# EAGLE design dimmer_encoder_controller (EAGLE 9.2.2)
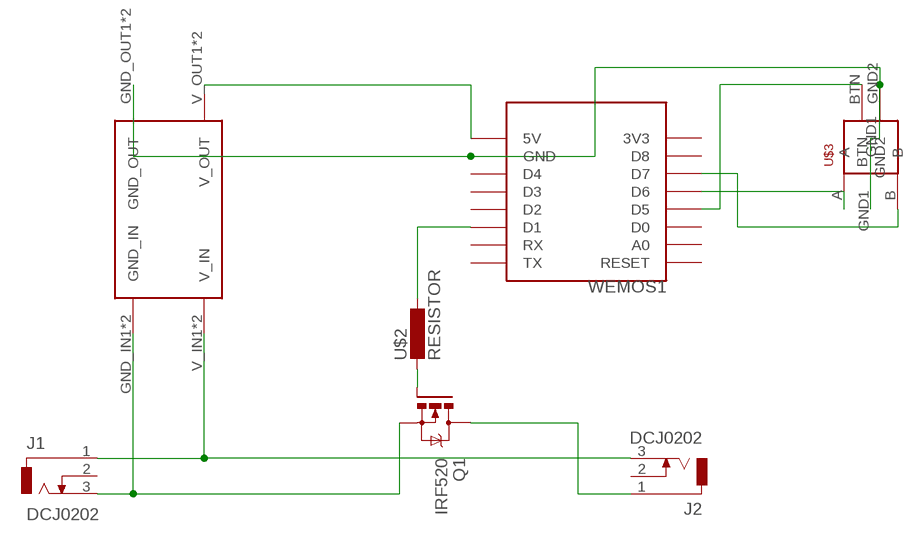
[diagram p0: schematic, sheet 1]

## Parts
J1  DCJ0202  [DCJ0202]
J2  DCJ0202  [DCJ0202]
Q1  IRF520  [TO220BV]
U$1  DC-DC-CONVERTER  [DC-DC-CONVERTER]
U$2  RESISTOR  [RESISTOR]
U$3  ROTARY_ENCODER  [ROTARY_ENCODER]
WEMOS1  WEMOS-D1-MINI  [WEMOS-D1-MINI]

## Nets
N$1: Q1.G U$2.2
N$2: U$1.V_OUT1(V_OUT) U$1.V_OUT2(V_OUT) WEMOS1.5V
N$3: U$1.GND_OUT1(GND_OUT) U$1.GND_OUT2(GND_OUT) U$3.GND1 U$3.GND2 WEMOS1.GND
N$4: U$2.1 WEMOS1.D1
N$5: J1.1 J2.3 U$1.V_IN1(V_IN) U$1.V_IN2(V_IN)
N$6: J1.3 Q1.S U$1.GND_IN1(GND_IN) U$1.GND_IN2(GND_IN)
N$7: J2.1 Q1.D
N$9: U$3.A WEMOS1.D6
N$10: U$3.B WEMOS1.D7
N$11: U$3.BTN WEMOS1.D5
Unconnected: J1.2 J2.2 WEMOS1.3V3 WEMOS1.A0 WEMOS1.D0 WEMOS1.D2 WEMOS1.D3 WEMOS1.D4 WEMOS1.D8 WEMOS1.RESET WEMOS1.RX WEMOS1.TX

## Library data of the parts
J1 J2 = con-jack:DCJ0202: DC POWER JACK Source: DCJ0202.pdf; OC_FARNELL: unknown; OC_NEWARK: unknown
Q1 = transistor-power:IRF520: HEXFET Power MOSFET
U$1 = mylib:DC-DC-CONVERTER
U$2 = mylib:RESISTOR
U$3 = mylib:ROTARY_ENCODER
WEMOS1 = esp8266modules:WEMOS-D1-MINI: WeMos.cc D1 mini ESP8266 module

## Board
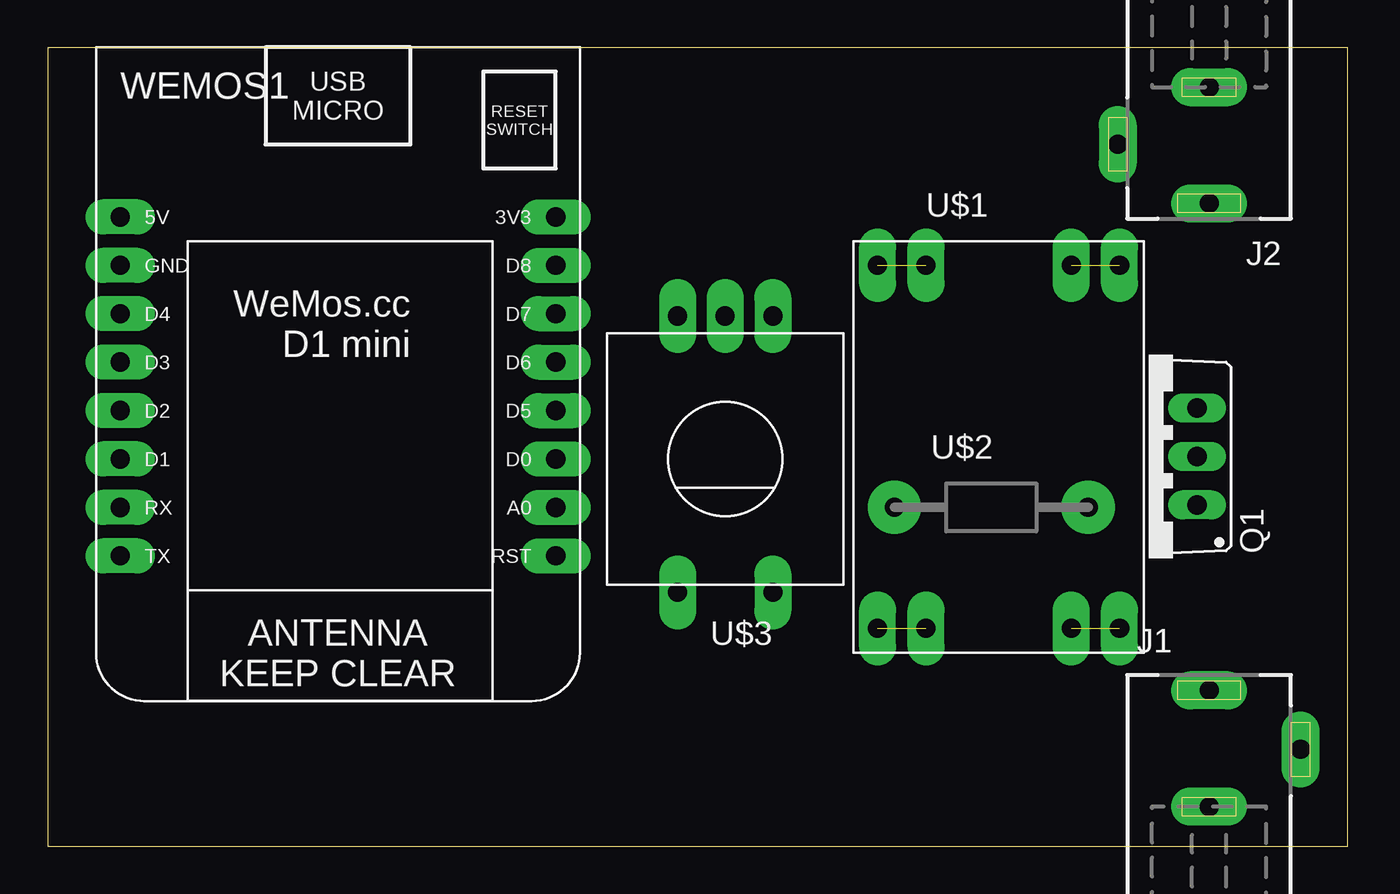
[diagram p1: board, top side]
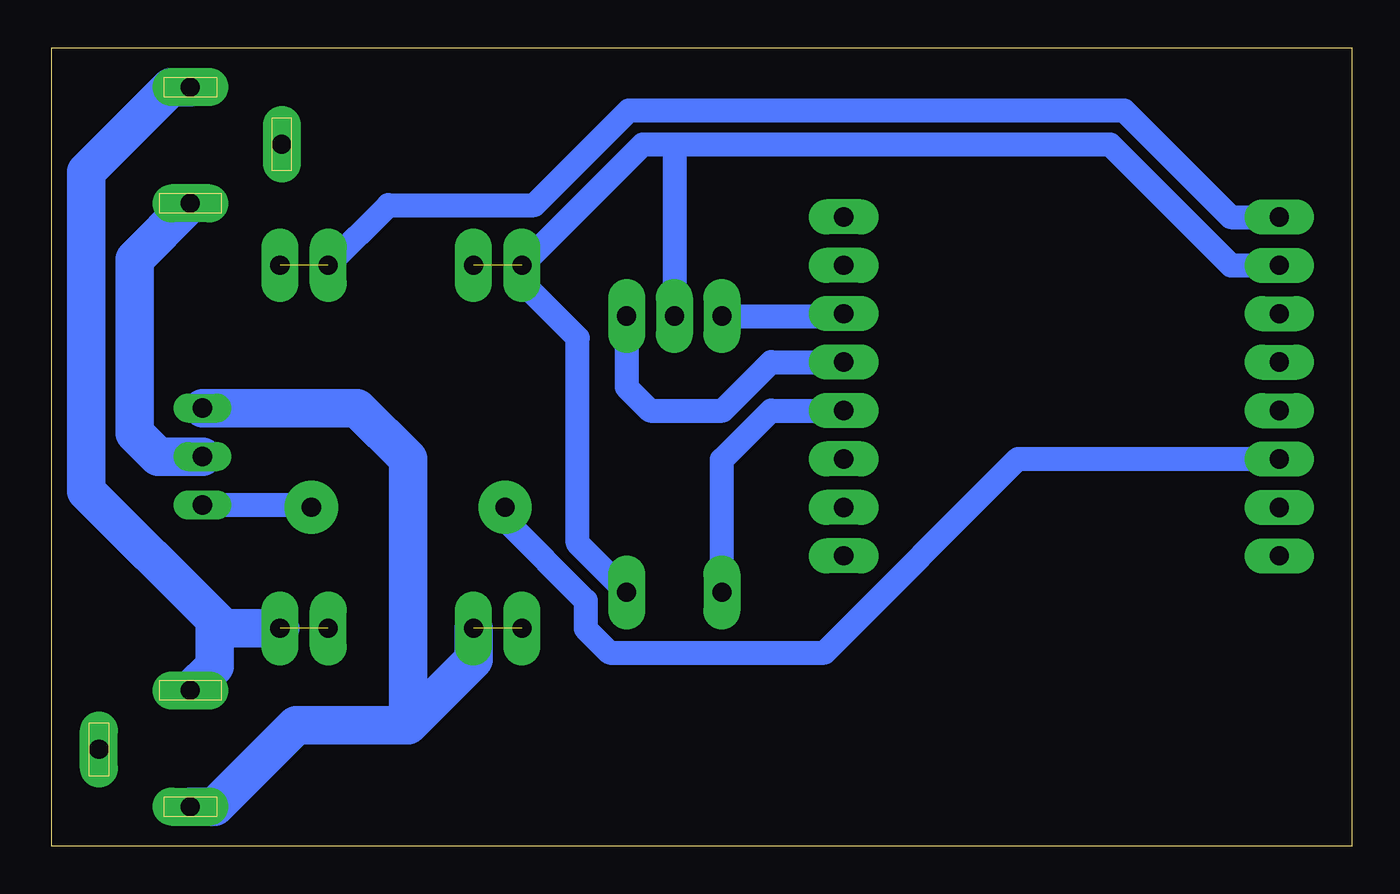
[diagram p2: board, bottom side, seen from below]

Size 68.25 x 41.9 mm. Coordinates in mm from the lower left corner, seen from the top.
Outline: 0,0 68.25,0 68.25,41.9 0,41.9 0,0
Copper layers (1*16): Top 0.035mm / dielectric 1.5mm / Bottom 0.035mm
Design rules "default": minimum track width 6mil, minimum drill 0.8mm, track to track 20mil, track to pad 20mil, pad to pad 10mil, via to via 10mil, smd to smd 6mil, copper to edge 40mil, drill to drill 6mil, minimum pad ring 10mil, minimum via ring 8mil, stop-mask expansion 4mil, vias tented up to drill 0mil, thermal gap 10mil

### Footprints (pad centres in the part's own frame; a part is rotated, then mirrored left to right if it is on the bottom)
DCJ0202 = drill 1 pad 2 long: 1 0,3.1; 2 4.8,0; 3 0,-3
TO220BV = drill 1.016 long: D 0,-2.54; G -2.54,-2.54; S 2.54,-2.54
DC-DC-CONVERTER = drill 1 pad 1.93 long: GND_IN1 -5.08,-11.43; GND_IN2 -2.54,-11.43; GND_OUT1 -5.08,7.62; GND_OUT2 -2.54,7.62; V_IN1 5.08,-11.43; V_IN2 7.62,-11.43; V_OUT1 5.08,7.62; V_OUT2 7.62,7.62
RESISTOR = drill 1 pad 2.794: 1 -7.62,0; 2 2.54,0
ROTARY_ENCODER = drill 1 pad 1.93 long: A -2.5,-7.5; B 2.5,-7.5; BTN 2.5,7; GND1 0,-7.5; GND2 -2.5,7
WEMOS-D1-MINI = drill 1.016 pad 1.829 long: 3V3 -10.16,-10.16; 5V 12.7,-10.16; A0 -10.16,5.08; D0 -10.16,2.54; D1 12.7,2.54; D2 12.7,0; D3 12.7,-2.54; D4 12.7,-5.08; D5 -10.16,0; D6 -10.16,-2.54; D7 -10.16,-5.08; D8 -10.16,-7.62; GND 12.7,-7.62; RESET -10.16,7.62; RX 12.7,5.08; TX 12.7,7.62

### Placement (x,y rotation side)
J1  60.96,5.08 0 top
J2  60.96,36.83 180 top
Q1  57.79,20.45 90 top
U$1  48.64,22.86 0 top
U$2  52.07,17.78 0 top
U$3  35.56,20.32 180 top
WEMOS1  16.51,22.86 180 top

### Tracks (layer width: path | path; a pad name or v marks a point on that pad's centre or on a via)
N$1
  Bottom 1.27: Q1.G 54.74,17.91 U$2.2
N$2  (1 unrouted)
  Bottom 1.27: U$1.V_OUT1 50.56,33.64 42.92,33.64 37.95,38.61 11.96,38.61 6.36,33.01 3.82,33.01 WEMOS1.5V
N$3  (1 unrouted)
  Bottom 1.27: 35.56,36.83 37.21,36.83 U$1.GND_OUT1 43.56,29.59 40.64,26.67 40.64,15.9 U$3.GND2 | 35.56,36.83 12.7,36.83 6.35,30.48 WEMOS1.GND | 35.56,36.83 U$3.GND1
N$4
  Bottom 1.27: U$2.1 44.45,17.13 40.21,12.89 40.21,11.42 38.95,10.16 27.68,10.16 17.52,20.32 WEMOS1.D1
N$5  (1 unrouted)
  Bottom 2.032: J2.3 61.99,39.83 66.42,35.4 66.42,18.63 59.69,11.9 | 59.69,11.9 59.69,9.45 J1.1 | 59.69,11.9 59.22,11.43 U$1.V_IN2
N$6  (1 unrouted)
  Bottom 2.032: J1.3 59.69,2.08 55.42,6.35 49.53,6.35 | 49.53,6.35 46.1,9.78 U$1.GND_IN2 | 49.53,6.35 49.53,20.32 52.2,22.99 Q1.S
N$7
  Bottom 2.032: Q1.D 62.65,20.45 63.88,21.68 63.88,30.81 J2.1
N$9
  Bottom 1.27: U$3.A 38.06,24.09 36.83,22.86 33.02,22.86 30.48,25.4 WEMOS1.D6
N$10
  Bottom 1.27: U$3.B 26.79,27.82 WEMOS1.D7
N$11
  Bottom 1.27: U$3.BTN 33.06,20.28 30.48,22.86 WEMOS1.D5